# Altium schematic sheet Headers.SchDoc
size A4
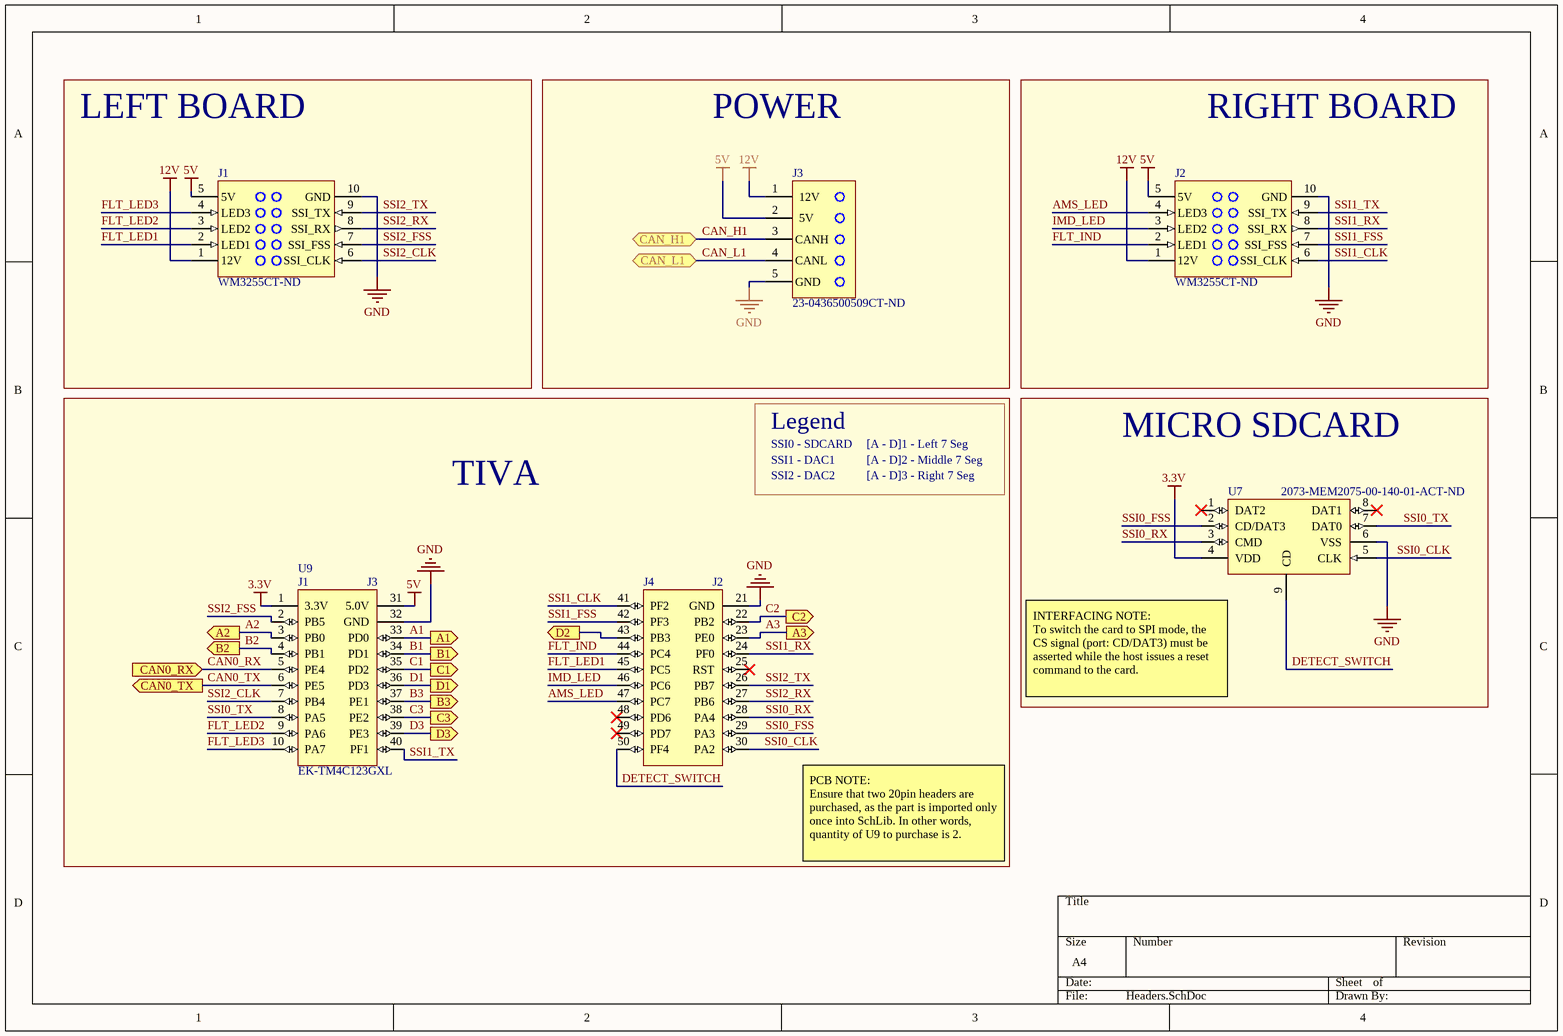
[diagram p0: Headers.SchDoc]

## Parts
J1  WM3255CT-ND  [MOLEX-10PIN]
J2  WM3255CT-ND  [MOLEX-10PIN]
J3  23-0436500509CT-ND  [MOLEX-5PIN]
U7  2073-MEM2075-00-140-01-ACT-ND  [SDCARD-NORMAL]
U9  EK-TM4C123GXL  [TIVA Headers]

## Blocks framed on the sheet
LEFT BOARD: J1
POWER: J3
RIGHT BOARD: J2
TIVA: U9
MICRO SDCARD: U7

## Ports
A1 (out), A2 (out), A3 (out), B1 (out), B2 (out), B3 (out), C1 (out), C2 (out), C3 (out), CAN0_RX (in), CAN0_TX (out), CAN_H1 (bidir), CAN_L1 (bidir), D1 (out), D2 (out), D3 (out)

## Nets
3.3V: U7.4(VDD) U9.1(3.3V)
5V: J1.5(5V) J2.5(5V) J3.2(5V) U9.31(5.0V)
12V: J1.1(12V) J2.1(12V) J3.1(12V)
GND: J1.10(GND) J2.10(GND) J3.5(GND) U7.6(VSS) U9.21(GND) U9.32(GND)
A1: U9.33(PD0) ; port A1
A2: U9.3(PB0) ; port A2
A3: U9.23(PE0) ; port A3
AMS_LED: J2.4(LED3) U9.47(PC7)
B1: U9.34(PD1) ; port B1
B2: U9.4(PB1) ; port B2
B3: U9.37(PE1) ; port B3
C1: U9.35(PD2) ; port C1
C2: U9.22(PB2) ; port C2
C3: U9.38(PE2) ; port C3
CAN0_RX: U9.5(PE4) ; port CAN0_RX
CAN0_TX: U9.6(PE5) ; port CAN0_TX
CAN_H1: J3.3(CANH) ; port CAN_H1
CAN_L1: J3.4(CANL) ; port CAN_L1
D1: U9.36(PD3) ; port D1
D2: U9.43(PB3) ; port D2
D3: U9.39(PE3) ; port D3
DETECT_SWITCH: U7.9(CD) U9.50(PF4)
FLT_IND: J2.2(LED1) U9.44(PC4)
FLT_LED1: J1.2(LED1) U9.45(PC5)
FLT_LED2: J1.3(LED2) U9.9(PA6)
FLT_LED3: J1.4(LED3) U9.10(PA7)
IMD_LED: J2.3(LED2) U9.46(PC6)
SSI0_CLK: U7.5(CLK) U9.30(PA2)
SSI0_FSS: U7.2(CD/DAT3) U9.29(PA3)
SSI0_RX: U7.3(CMD) U9.28(PA4)
SSI0_TX: U7.7(DAT0) U9.8(PA5)
SSI1_CLK: J2.6(SSI_CLK) U9.41(PF2)
SSI1_FSS: J2.7(SSI_FSS) U9.42(PF3)
SSI1_RX: J2.8(SSI_RX) U9.24(PF0)
SSI1_TX: J2.9(SSI_TX) U9.40(PF1)
SSI2_CLK: J1.6(SSI_CLK) U9.7(PB4)
SSI2_FSS: J1.7(SSI_FSS) U9.2(PB5)
SSI2_RX: J1.8(SSI_RX) U9.27(PB6)
SSI2_TX: J1.9(SSI_TX) U9.26(PB7)

Not connected (* = marked no-connect by the designer): U7 1(DAT2)* 8(DAT1)*; U9 25(RST)* 48(PD6)* 49(PD7)*

## Notes on the sheet
- SSI0 - SDCARD
- Legend
- [A - D]1 - Left 7 Seg
- SSI1 - DAC1
- SSI2 - DAC2
- [A - D]2 - Middle 7 Seg
- [A - D]3 - Right 7 Seg
- (near U7) INTERFACING NOTE:
  To switch the card to SPI mode, the CS signal (port: CD/DAT3) must be asserted while the host issues a reset command to the card.
- PCB NOTE:
  Ensure that two 20pin headers are purchased, as the part is imported only once into SchLib. In other words, quantity of U9 to purchase is 2.
- (in symbol PH2-20-UA) J1; J3; J4; J2

## Library data of the parts
J1 J2 = MOLEX-10PIN: HEADER R/A 10POS DUAL TIN SMD; Manufacturer: Molex; Manufacturer Part Number: 0430451006; Contact Resistance: 10mR; Number of Positions: 10; Connector Type: Male Pin; Pitch: 3mm; Row Spacing: 0.118inch; Supplier 1: Digi-Key; Stock 1: 2460; Pricing 1: 1=3.72000, 10=3.57200, 100=2.97680 (USD); RoHS: Yes; Mount: Surface Mount; Contact Plating: Tin; Contact Material: Brass; Color: Black; Housing Material: Polymer; Housing Color: Black; Min Operating Temperature: -40°C; Max Operating Temperature: 105°C; Number of Rows: 2; Packaging: Tape and Reel; Termination: Solder; Number of Contacts: 10; Orientation: Right Angle; Fastening Type: Latch; Length: 19.15mm; Depth: 15.4mm; ComponentLink1URL: https://datasheet.ciiva.com/737/430450407-sd-737953.pdf?src-supplier=Digi-Key; ComponentLink1Description: https://datasheet.ciiva.com/737/430450407-sd-737953.pdf?src-supplier=Digi-Key; Supplier Part Number 1: WM3255CT-ND
J3 = 0436500509: GLOVE, POLYAMIDE, L/FREE, PU, SIZE 6 - More Details; Manufacturer: Molex; Max Voltage Rating (AC): 250V; Number of Contacts: 5; Current Rating: 5A; Voltage Rating: 600V; Gender: Male; Connector Type: Male Pin; Pitch: 3mm; Glow Wire Compliant: Compliant; Supplier 1: Digi-Key; Manufacturer Part Number: 0436500509; Stock 1: 8420; Pricing 1: 1=2.58000, 10=2.34500, 100=2.00970 (USD); RoHS: Yes; Mount: Surface Mount; Contact Plating: Tin; Contact Material: Brass; Color: Black; Housing Color: Black; Housing Material: Polymer; Min Operating Temperature: -40°C; Max Operating Temperature: 105°C; Termination: Solder; Orientation: Right Angle; Number of Rows: 1; Packaging: Tape and Reel; Package Quantity: 10; Fastening Type: Ramp; Contact Gender: Male; Number of Positions: 5; Voltage Rating (DC): 250V; Number of Circuits: 5; Halogen Free: Low Halogen; ComponentLink1URL: https://datasheet.ciiva.com/712/436501209-sd-712211.pdf?src-supplier=Digi-Key; ComponentLink1Description: https://datasheet.ciiva.com/712/436501209-sd-712211.pdf?src-supplier=Digi-Key; ComponentLink2URL: https://datasheet.ciiva.com/16089/0436500509-pcb-headers-16089055.pdf?src-supplier=Onlinecomponents.com; ComponentLink2Description: https://datasheet.ciiva.com/16089/0436500509-pcb-headers-16089055.pdf?src-supplier=Onlinecomponents.com; Supplier Part Number 1: 23-0436500509CT-ND
U7 = SDCARD CONN.: 850NM POINT SOURCE LED ASSY; Manufacturer: Global Connector Technology; Supplier 1: Newark; Manufacturer Part Number: MEM2075-00-140-01-A; Stock 1: 1028; Pricing 1: 1=1.68000, 10=1.53000, 25=1.53000, 50=1.53000, 100=1.42000, 250=1.42000, 500=1.32000, 1000=1.23000, 1=1.26000, 10=1.15000, 25=1.15000, 50=1.15000, 100=1.07000, 250=1.07000, 500=0.98600, 1000=0.92000 (CAD); RoHS: No; Supplier Part Number 1: 56AC1963
U9 = PH2-20-UA: PH Series 20 Position Through-Hole Dual Row Straight .100 Header; Manufacturer: Adam Equipment; Number of Positions: 20; Pitch: 2.54mm; Supplier 1: Digi-Key; Manufacturer Part Number: PH2-20-UA; Stock 1: 6280; Pricing 1: 1=0.26000, 10=0.24700, 100=0.17300, 500=0.14826, 1000=0.12355, 5000=0.10590, 10000=0.09884 (USD); RoHS: Yes; Mount: Through Hole; Contact Plating: Gold; Termination: Solder; Packaging: Bag; Lead Free: Lead Free; ComponentLink1URL: https://datasheet.ciiva.com/16479/page-312-315-16479356.pdf?src-supplier=Future+Electronics; ComponentLink1Description: https://datasheet.ciiva.com/16479/page-312-315-16479356.pdf?src-supplier=Future+Electronics; Supplier Part Number 1: 2057-PH2-20-UA-ND